# Altium schematic sheet iPhone11-2WAI.SchDoc
size A
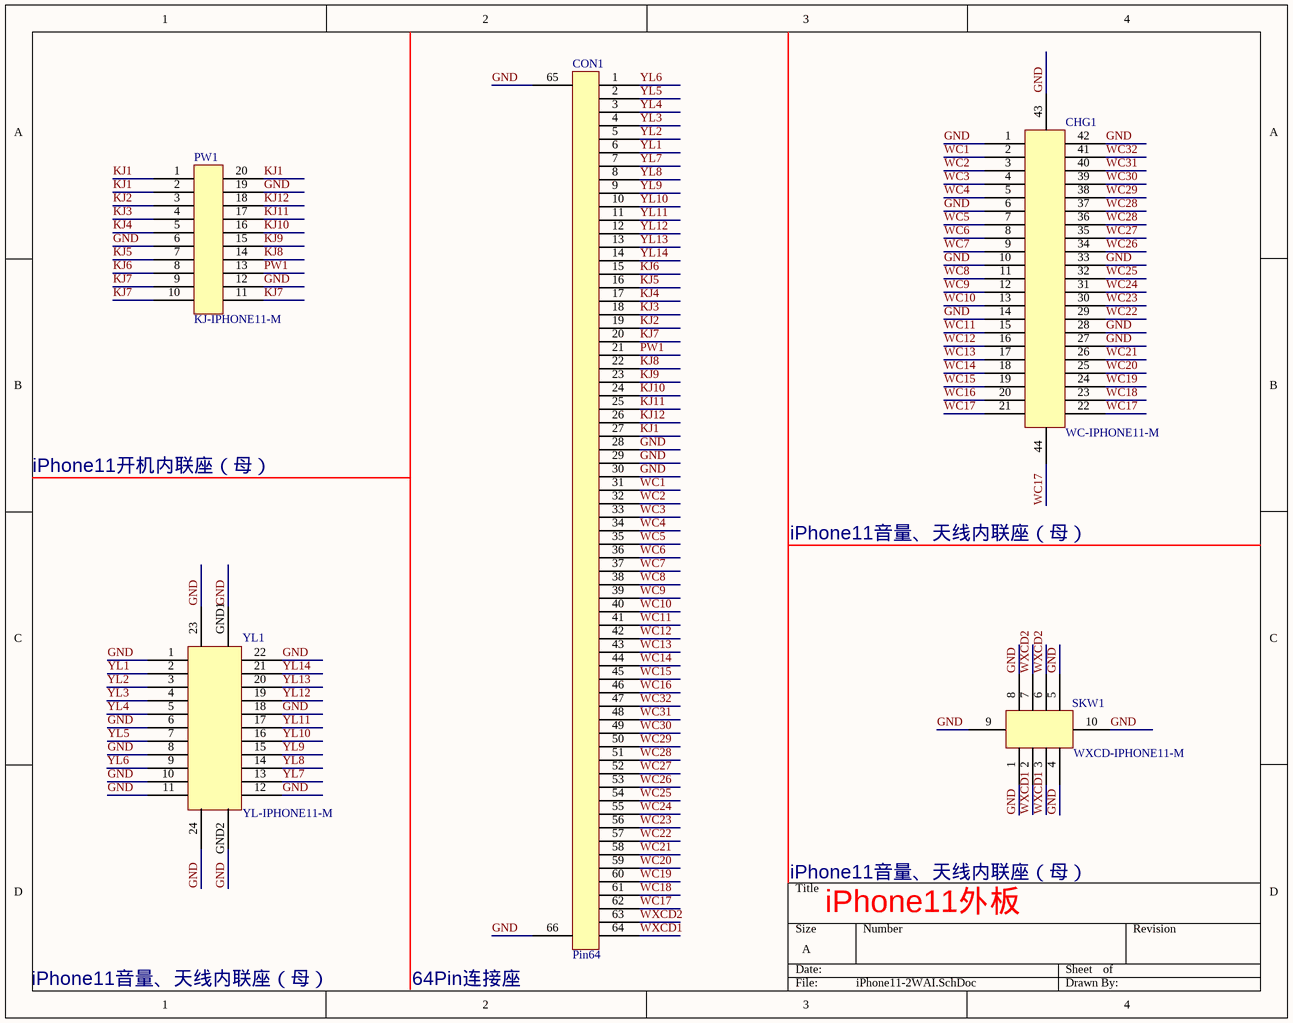
[diagram p0: iPhone11-2WAI.SchDoc]

## Parts
CHG1  WC-IPHONE11-M  [IPHONE11-WC-M]
CON1  Pin64  [Pin64]
PW1  KJ-IPHONE11-M  [IPHONE11-KJ-M]
SKW1  WXCD-IPHONE11-M  [IPHONE11-WXCD-M]
YL1  YL-IPHONE11-M  [IPHONE11-YL-M]

## Nets
GND: CHG1.1 CHG1.6 CHG1.10 CHG1.14 CHG1.27 CHG1.28 CHG1.33 CHG1.42 CHG1.43 CON1.28 CON1.29 CON1.30 CON1.65 CON1.66 PW1.6 PW1.12 PW1.19 SKW1.1 SKW1.4 SKW1.5 SKW1.8 SKW1.9 SKW1.10 YL1.1 YL1.6 YL1.8 YL1.10 YL1.11 YL1.12 YL1.18 YL1.22 YL1.23 YL1.24 YL1.GND1 YL1.GND2
KJ1: CON1.27 PW1.1 PW1.2 PW1.20
KJ2: CON1.19 PW1.3
KJ3: CON1.18 PW1.4
KJ4: CON1.17 PW1.5
KJ5: CON1.16 PW1.7
KJ6: CON1.15 PW1.8
KJ7: CON1.20 PW1.9 PW1.10 PW1.11
KJ8: CON1.22 PW1.14
KJ9: CON1.23 PW1.15
KJ10: CON1.24 PW1.16
KJ11: CON1.25 PW1.17
KJ12: CON1.26 PW1.18
PW1: CON1.21 PW1.13
WC1: CHG1.2 CON1.31
WC2: CHG1.3 CON1.32
WC3: CHG1.4 CON1.33
WC4: CHG1.5 CON1.34
WC5: CHG1.7 CON1.35
WC6: CHG1.8 CON1.36
WC7: CHG1.9 CON1.37
WC8: CHG1.11 CON1.38
WC9: CHG1.12 CON1.39
WC10: CHG1.13 CON1.40
WC11: CHG1.15 CON1.41
WC12: CHG1.16 CON1.42
WC13: CHG1.17 CON1.43
WC14: CHG1.18 CON1.44
WC15: CHG1.19 CON1.45
WC16: CHG1.20 CON1.46
WC17: CHG1.21 CHG1.22 CHG1.44 CON1.62
WC18: CHG1.23 CON1.61
WC19: CHG1.24 CON1.60
WC20: CHG1.25 CON1.59
WC21: CHG1.26 CON1.58
WC22: CHG1.29 CON1.57
WC23: CHG1.30 CON1.56
WC24: CHG1.31 CON1.55
WC25: CHG1.32 CON1.54
WC26: CHG1.34 CON1.53
WC27: CHG1.35 CON1.52
WC28: CHG1.36 CHG1.37 CON1.51
WC29: CHG1.38 CON1.50
WC30: CHG1.39 CON1.49
WC31: CHG1.40 CON1.48
WC32: CHG1.41 CON1.47
WXCD1: CON1.64 SKW1.2 SKW1.3
WXCD2: CON1.63 SKW1.6 SKW1.7
YL1: CON1.6 YL1.2
YL2: CON1.5 YL1.3
YL3: CON1.4 YL1.4
YL4: CON1.3 YL1.5
YL5: CON1.2 YL1.7
YL6: CON1.1 YL1.9
YL7: CON1.7 YL1.13
YL8: CON1.8 YL1.14
YL9: CON1.9 YL1.15
YL10: CON1.10 YL1.16
YL11: CON1.11 YL1.17
YL12: CON1.12 YL1.19
YL13: CON1.13 YL1.20
YL14: CON1.14 YL1.21

## Notes on the sheet
- iPhone11开机内联座（母）
- iPhone11音量、天线内联座（母）
- iPhone11外板
- 64Pin连接座